# EAGLE schematic control (EAGLE 9.5.2)
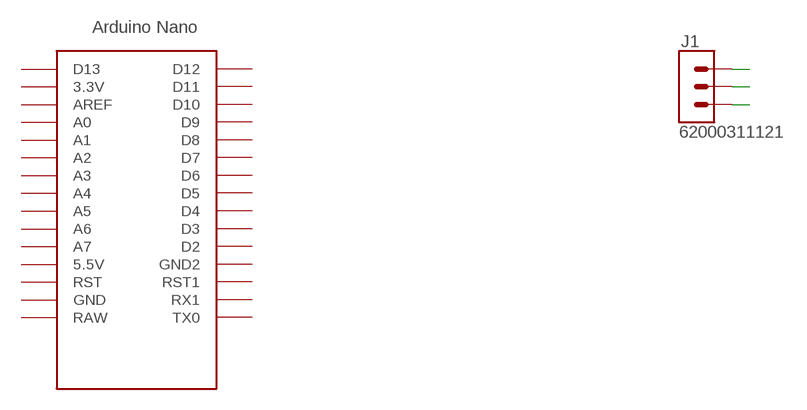
[diagram p0: schematic, sheet 1]

## Parts
J1  62000311121  [62000311121]
U$1  NANO  [NANO]

## Nets
N$1: J1.3
N$2: J1.2
N$3: J1.1
Unconnected: U$1.3.3V U$1.5V(5.5V) U$1.A0 U$1.A1 U$1.A2 U$1.A3 U$1.A4 U$1.A5 U$1.A6 U$1.A7 U$1.AREF U$1.D2 U$1.D3 U$1.D4 U$1.D5 U$1.D6 U$1.D7 U$1.D8 U$1.D9 U$1.D10 U$1.D11 U$1.D12 U$1.D13 U$1.GND U$1.GND1(GND2) U$1.ICSP1 U$1.ICSP2 U$1.ICSP3 U$1.ICSP4 U$1.ICSP5 U$1.ICSP6 U$1.RAW U$1.RST U$1.RST1 U$1.RX1 U$1.TX0

## Library data of the parts
J1 = Headers:62000311121: THT Vertical Pin Header WR-PHD, Pitch 2.00 mm, Single Row, 3 pins Manufacturer's datasheet <https://datasheet.octopart.com/62000311121-W%C3%BCrth-Elektronik-datasheet-117282002.pdf>; CREATED_BY: PCBLayout.com; MANUFACTURER: Würth Elektronik; MPN: 62000311121
U$1 = Arduino-clone:NANO: Arduino Nano